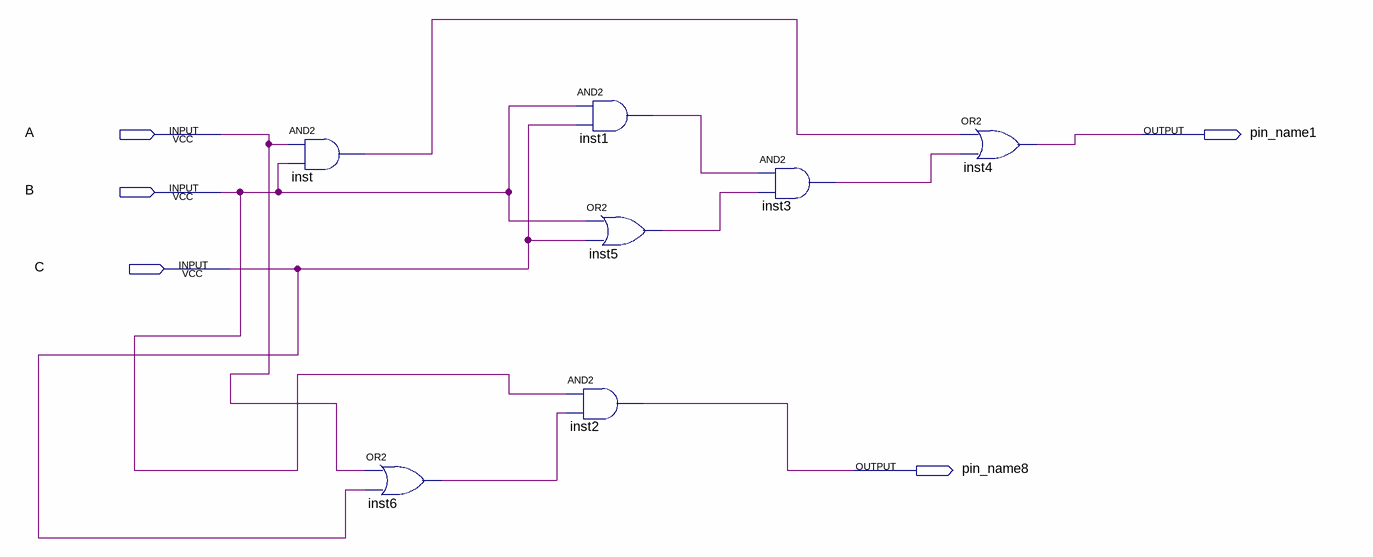
[diagram p0: schematic sheet]
// Quartus schematic projeto_aula01.bdf as structural Verilog: 7 symbols, 5 pins
module projeto_aula01 (
  input  A,
  input  B,
  input  C,
  output pin_name1,
  output pin_name8
);

  wire inst1_out, inst3_out, inst5_out, inst6_out, inst_out;

  and inst (inst_out, A, B);
  or inst6 (inst6_out, A, C);
  and inst1 (inst1_out, B, C);
  or inst5 (inst5_out, B, C);
  and inst2 (pin_name8, B, inst6_out);
  and inst3 (inst3_out, inst1_out, inst5_out);
  or inst4 (pin_name1, inst_out, inst3_out);
endmodule
